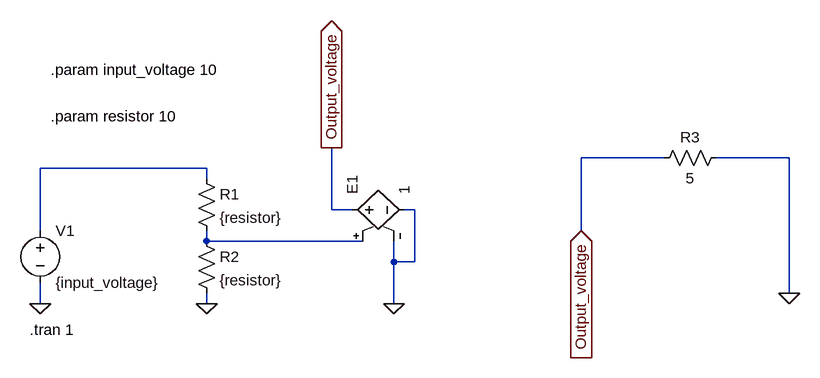
[diagram p0: schematic Voltage input_output label nets.asc]
Voltage input_output label nets.asc, the LTspice schematic file:
Version 4
SHEET 1 1204 680
WIRE 976 0 848 0
WIRE 1168 0 1056 0
WIRE 272 16 16 16
WIRE 272 32 272 16
WIRE 464 80 464 -16
WIRE 496 80 464 80
WIRE 592 80 576 80
WIRE 16 112 16 16
WIRE 848 112 848 0
WIRE 272 128 272 112
WIRE 512 128 272 128
WIRE 560 160 560 128
WIRE 592 160 592 80
WIRE 592 160 560 160
WIRE 1168 208 1168 0
WIRE 16 224 16 192
WIRE 272 224 272 208
WIRE 560 224 560 160
FLAG 272 224 0
FLAG 16 224 0
FLAG 560 224 0
FLAG 464 -16 Output_voltage
IOPIN 464 -16 Out
FLAG 848 112 Output_voltage
IOPIN 848 112 In
FLAG 1168 208 0
SYMBOL voltage 16 96 R0
WINDOW 123 0 0 Left 0
WINDOW 39 0 0 Left 0
SYMATTR InstName V1
SYMATTR Value {input_voltage}
SYMBOL res 256 16 R0
SYMATTR InstName R1
SYMATTR Value {resistor}
SYMBOL res 256 112 R0
SYMATTR InstName R2
SYMATTR Value {resistor}
SYMBOL e 480 80 R270
SYMATTR InstName E1
SYMATTR Value 1
SYMBOL res 1072 -16 R90
WINDOW 0 0 56 VBottom 2
WINDOW 3 32 56 VTop 2
SYMATTR InstName R3
SYMATTR Value 5
TEXT 0 264 Left 2 !.tran 1
TEXT 32 -136 Left 2 !.param input_voltage 10
TEXT 32 -64 Left 2 !.param resistor 10

The netlist it stands for:
* Voltage input_output label nets.asc
V1 N001 0 {input_voltage}
R1 N001 N002 {resistor}
R2 N002 0 {resistor}
E1 Output_voltage 0 N002 0 1
R3 0 Output_voltage 5
.tran 1
.param input_voltage 10
.param resistor 10
.backanno
.end